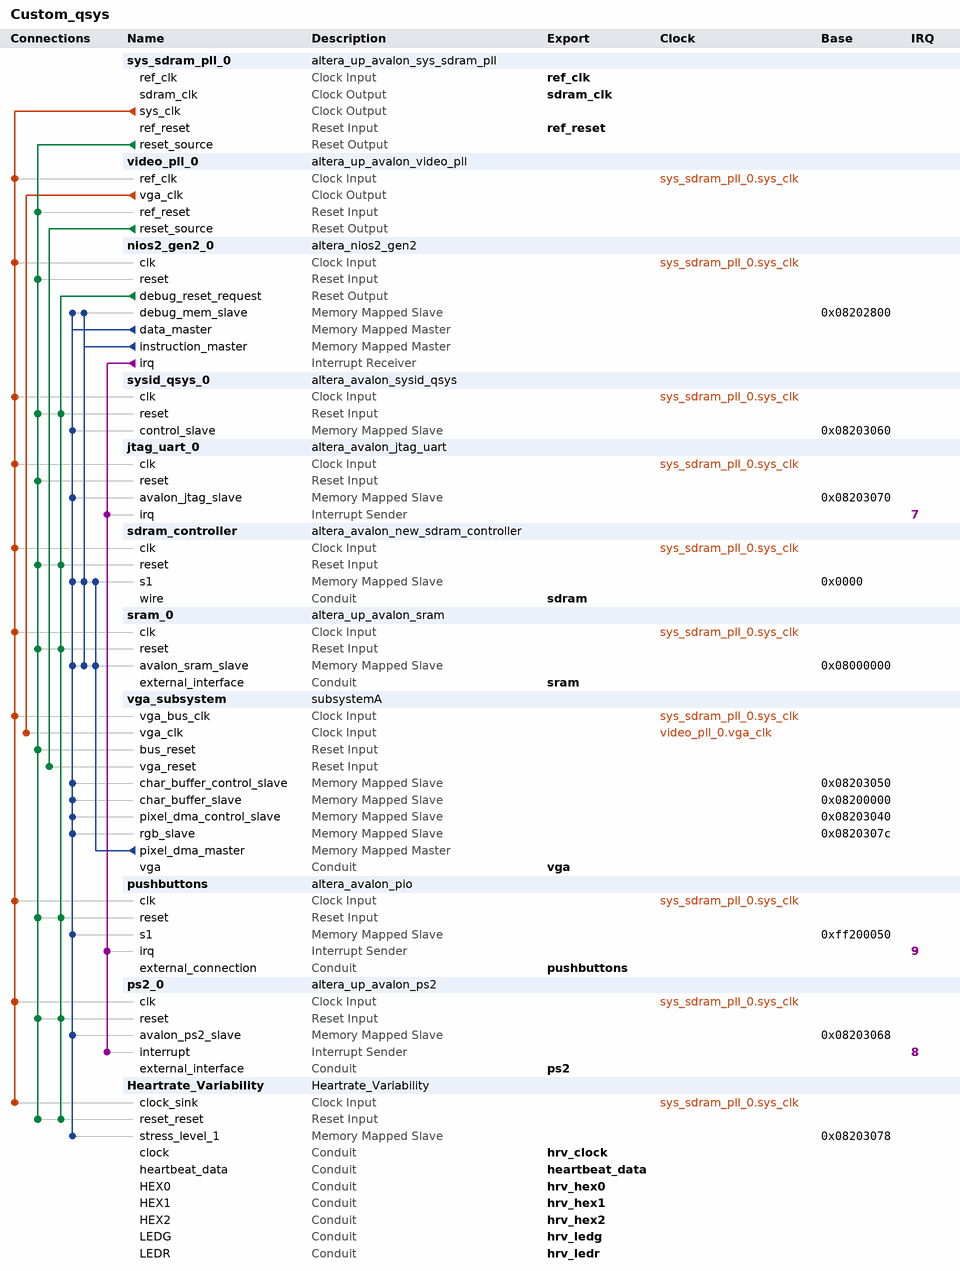
[diagram p0: system contents]
# Platform Designer (Qsys) system Custom_qsys, Cyclone IV E EP4CE115F29C7
# Parameters at their usual value, and those the tool derives, are not listed.
package require -exact qsys 18.1
create_system Custom_qsys
set_project_property DEVICE_FAMILY {Cyclone IV E}
set_project_property DEVICE EP4CE115F29C7

add_instance sys_sdram_pll_0 altera_up_avalon_sys_sdram_pll 18.0
set_instance_parameter_value sys_sdram_pll_0 CV_boards DE10-Standard
set_instance_parameter_value sys_sdram_pll_0 gui_outclk 50.0
set_instance_parameter_value sys_sdram_pll_0 gui_refclk 50.0

add_instance video_pll_0 altera_up_avalon_video_pll 18.0
set_instance_parameter_value video_pll_0 camera {5MP Digital Camera (THDB_D5M)}
set_instance_parameter_value video_pll_0 gui_refclk 50.0
set_instance_parameter_value video_pll_0 lcd {7" LCD on VEEK-MT and MTL/MTL2 Modules}

add_instance nios2_gen2_0 altera_nios2_gen2 18.1
set_instance_parameter_value nios2_gen2_0 dcache_size 2048
set_instance_parameter_value nios2_gen2_0 exceptionSlave sdram_controller.s1
set_instance_parameter_value nios2_gen2_0 icache_size 4096
set_instance_parameter_value nios2_gen2_0 impl Tiny
set_instance_parameter_value nios2_gen2_0 resetSlave sdram_controller.s1

add_instance sysid_qsys_0 altera_avalon_sysid_qsys 18.1
set_instance_parameter_value sysid_qsys_0 id 16

add_instance jtag_uart_0 altera_avalon_jtag_uart 18.1
set_instance_parameter_value jtag_uart_0 simInteractiveOptions NO_INTERACTIVE_WINDOWS

add_instance sdram_controller altera_avalon_new_sdram_controller 18.1
set_instance_parameter_value sdram_controller TAC 5.5
set_instance_parameter_value sdram_controller TRCD 20.0
set_instance_parameter_value sdram_controller TRP 20.0
set_instance_parameter_value sdram_controller casLatency 3
set_instance_parameter_value sdram_controller columnWidth 10
set_instance_parameter_value sdram_controller dataWidth 32
set_instance_parameter_value sdram_controller generateSimulationModel false
set_instance_parameter_value sdram_controller model single_Micron_MT48LC4M32B2_7_chip
set_instance_parameter_value sdram_controller numberOfBanks 4
set_instance_parameter_value sdram_controller numberOfChipSelects 1
set_instance_parameter_value sdram_controller powerUpDelay 200.0
set_instance_parameter_value sdram_controller refreshPeriod 7.8125
set_instance_parameter_value sdram_controller rowWidth 13

add_instance sram_0 altera_up_avalon_sram 18.0
set_instance_parameter_value sram_0 board DE2-115
set_instance_parameter_value sram_0 pixel_buffer true

add_instance vga_subsystem subsystemA 1.0

add_instance pushbuttons altera_avalon_pio 18.1
set_instance_parameter_value pushbuttons bitClearingEdgeCapReg true
set_instance_parameter_value pushbuttons captureEdge true
set_instance_parameter_value pushbuttons direction Input
set_instance_parameter_value pushbuttons generateIRQ true
set_instance_parameter_value pushbuttons irqType EDGE
set_instance_parameter_value pushbuttons simDoTestBenchWiring true
set_instance_parameter_value pushbuttons width 4

add_instance ps2_0 altera_up_avalon_ps2 18.0

add_instance Heartrate_Variability Heartrate_Variability 1.0

# connections
add_connection sys_sdram_pll_0.sys_clk Heartrate_Variability.clock_sink clock
add_connection sys_sdram_pll_0.sys_clk jtag_uart_0.clk clock
add_connection sys_sdram_pll_0.sys_clk nios2_gen2_0.clk clock
add_connection sys_sdram_pll_0.sys_clk ps2_0.clk clock
add_connection sys_sdram_pll_0.sys_clk pushbuttons.clk clock
add_connection sys_sdram_pll_0.sys_clk sdram_controller.clk clock
add_connection sys_sdram_pll_0.sys_clk sram_0.clk clock
add_connection sys_sdram_pll_0.sys_clk sysid_qsys_0.clk clock
add_connection sys_sdram_pll_0.sys_clk vga_subsystem.vga_bus_clk clock
add_connection sys_sdram_pll_0.sys_clk video_pll_0.ref_clk clock
add_connection video_pll_0.vga_clk vga_subsystem.vga_clk clock
add_connection nios2_gen2_0.debug_reset_request Heartrate_Variability.reset_reset reset
add_connection nios2_gen2_0.debug_reset_request ps2_0.reset reset
add_connection nios2_gen2_0.debug_reset_request pushbuttons.reset reset
add_connection nios2_gen2_0.debug_reset_request sdram_controller.reset reset
add_connection nios2_gen2_0.debug_reset_request sram_0.reset reset
add_connection nios2_gen2_0.debug_reset_request sysid_qsys_0.reset reset
add_connection sys_sdram_pll_0.reset_source Heartrate_Variability.reset_reset reset
add_connection sys_sdram_pll_0.reset_source jtag_uart_0.reset reset
add_connection sys_sdram_pll_0.reset_source nios2_gen2_0.reset reset
add_connection sys_sdram_pll_0.reset_source ps2_0.reset reset
add_connection sys_sdram_pll_0.reset_source pushbuttons.reset reset
add_connection sys_sdram_pll_0.reset_source sdram_controller.reset reset
add_connection sys_sdram_pll_0.reset_source sram_0.reset reset
add_connection sys_sdram_pll_0.reset_source sysid_qsys_0.reset reset
add_connection sys_sdram_pll_0.reset_source vga_subsystem.bus_reset reset
add_connection sys_sdram_pll_0.reset_source video_pll_0.ref_reset reset
add_connection video_pll_0.reset_source vga_subsystem.vga_reset reset
add_connection nios2_gen2_0.data_master Heartrate_Variability.stress_level_1 avalon
set_connection_parameter_value nios2_gen2_0.data_master/Heartrate_Variability.stress_level_1 baseAddress 0x08203078
add_connection nios2_gen2_0.data_master jtag_uart_0.avalon_jtag_slave avalon
set_connection_parameter_value nios2_gen2_0.data_master/jtag_uart_0.avalon_jtag_slave baseAddress 0x08203070
add_connection nios2_gen2_0.data_master nios2_gen2_0.debug_mem_slave avalon
set_connection_parameter_value nios2_gen2_0.data_master/nios2_gen2_0.debug_mem_slave baseAddress 0x08202800
add_connection nios2_gen2_0.data_master ps2_0.avalon_ps2_slave avalon
set_connection_parameter_value nios2_gen2_0.data_master/ps2_0.avalon_ps2_slave baseAddress 0x08203068
add_connection nios2_gen2_0.data_master pushbuttons.s1 avalon
set_connection_parameter_value nios2_gen2_0.data_master/pushbuttons.s1 baseAddress 0xff200050
add_connection nios2_gen2_0.data_master sdram_controller.s1 avalon
set_connection_parameter_value nios2_gen2_0.data_master/sdram_controller.s1 baseAddress 0x0000
add_connection nios2_gen2_0.data_master sram_0.avalon_sram_slave avalon
set_connection_parameter_value nios2_gen2_0.data_master/sram_0.avalon_sram_slave baseAddress 0x08000000
add_connection nios2_gen2_0.data_master sysid_qsys_0.control_slave avalon
set_connection_parameter_value nios2_gen2_0.data_master/sysid_qsys_0.control_slave baseAddress 0x08203060
add_connection nios2_gen2_0.data_master vga_subsystem.char_buffer_control_slave avalon
set_connection_parameter_value nios2_gen2_0.data_master/vga_subsystem.char_buffer_control_slave baseAddress 0x08203050
add_connection nios2_gen2_0.data_master vga_subsystem.char_buffer_slave avalon
set_connection_parameter_value nios2_gen2_0.data_master/vga_subsystem.char_buffer_slave baseAddress 0x08200000
add_connection nios2_gen2_0.data_master vga_subsystem.pixel_dma_control_slave avalon
set_connection_parameter_value nios2_gen2_0.data_master/vga_subsystem.pixel_dma_control_slave baseAddress 0x08203040
add_connection nios2_gen2_0.data_master vga_subsystem.rgb_slave avalon
set_connection_parameter_value nios2_gen2_0.data_master/vga_subsystem.rgb_slave baseAddress 0x0820307c
add_connection nios2_gen2_0.instruction_master nios2_gen2_0.debug_mem_slave avalon
set_connection_parameter_value nios2_gen2_0.instruction_master/nios2_gen2_0.debug_mem_slave baseAddress 0x08202800
add_connection nios2_gen2_0.instruction_master sdram_controller.s1 avalon
set_connection_parameter_value nios2_gen2_0.instruction_master/sdram_controller.s1 baseAddress 0x0000
add_connection nios2_gen2_0.instruction_master sram_0.avalon_sram_slave avalon
set_connection_parameter_value nios2_gen2_0.instruction_master/sram_0.avalon_sram_slave baseAddress 0x08000000
add_connection vga_subsystem.pixel_dma_master sdram_controller.s1 avalon
set_connection_parameter_value vga_subsystem.pixel_dma_master/sdram_controller.s1 baseAddress 0x0000
add_connection vga_subsystem.pixel_dma_master sram_0.avalon_sram_slave avalon
set_connection_parameter_value vga_subsystem.pixel_dma_master/sram_0.avalon_sram_slave baseAddress 0x08000000
add_connection nios2_gen2_0.irq jtag_uart_0.irq interrupt
set_connection_parameter_value nios2_gen2_0.irq/jtag_uart_0.irq irqNumber 7
add_connection nios2_gen2_0.irq ps2_0.interrupt interrupt
set_connection_parameter_value nios2_gen2_0.irq/ps2_0.interrupt irqNumber 8
add_connection nios2_gen2_0.irq pushbuttons.irq interrupt
set_connection_parameter_value nios2_gen2_0.irq/pushbuttons.irq irqNumber 9

# exported interfaces
add_interface heartbeat_data conduit end
set_interface_property heartbeat_data EXPORT_OF Heartrate_Variability.heartbeat_data
add_interface hrv_clock conduit end
set_interface_property hrv_clock EXPORT_OF Heartrate_Variability.clock
add_interface hrv_hex0 conduit end
set_interface_property hrv_hex0 EXPORT_OF Heartrate_Variability.HEX0
add_interface hrv_hex1 conduit end
set_interface_property hrv_hex1 EXPORT_OF Heartrate_Variability.HEX1
add_interface hrv_hex2 conduit end
set_interface_property hrv_hex2 EXPORT_OF Heartrate_Variability.HEX2
add_interface hrv_ledg conduit end
set_interface_property hrv_ledg EXPORT_OF Heartrate_Variability.LEDG
add_interface hrv_ledr conduit end
set_interface_property hrv_ledr EXPORT_OF Heartrate_Variability.LEDR
add_interface ps2 conduit end
set_interface_property ps2 EXPORT_OF ps2_0.external_interface
add_interface pushbuttons conduit end
set_interface_property pushbuttons EXPORT_OF pushbuttons.external_connection
add_interface ref_clk clock sink
set_interface_property ref_clk EXPORT_OF sys_sdram_pll_0.ref_clk
add_interface ref_reset reset sink
set_interface_property ref_reset EXPORT_OF sys_sdram_pll_0.ref_reset
add_interface sdram conduit end
set_interface_property sdram EXPORT_OF sdram_controller.wire
add_interface sdram_clk clock source
set_interface_property sdram_clk EXPORT_OF sys_sdram_pll_0.sdram_clk
add_interface sram conduit end
set_interface_property sram EXPORT_OF sram_0.external_interface
add_interface vga conduit end
set_interface_property vga EXPORT_OF vga_subsystem.vga

set_interconnect_requirement {$system} qsys_mm.clockCrossingAdapter HANDSHAKE
set_interconnect_requirement {$system} qsys_mm.enableEccProtection FALSE
set_interconnect_requirement {$system} qsys_mm.insertDefaultSlave FALSE
set_interconnect_requirement {$system} qsys_mm.maxAdditionalLatency 1

save_system Custom_qsys.qsys
